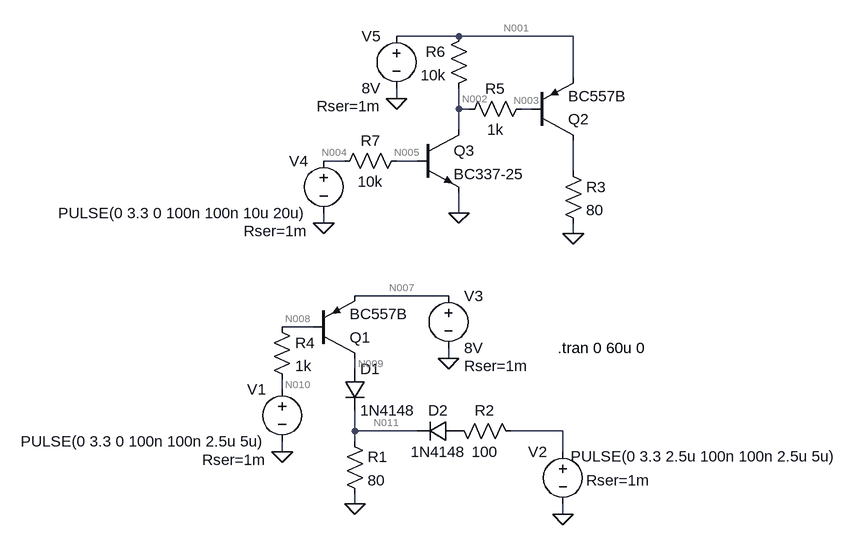
[diagram p0: schematic programador encoder.asc]
programador encoder.asc, the LTspice schematic file:
Version 4
SHEET 1 1852 684
WIRE 352 -208 256 -208
WIRE 528 -208 352 -208
WIRE 528 -144 528 -208
WIRE 256 -112 256 -128
WIRE 352 -96 352 -128
WIRE 368 -96 352 -96
WIRE 464 -96 448 -96
WIRE 352 -64 352 -96
WIRE 176 -16 144 -16
WIRE 288 -16 256 -16
WIRE 528 0 528 -48
WIRE 352 64 352 32
WIRE 144 80 144 64
WIRE 528 96 528 80
WIRE 336 192 192 192
WIRE 128 240 80 240
WIRE 336 288 336 272
WIRE 192 304 192 288
WIRE 80 336 80 320
WIRE 192 400 192 368
WIRE 288 400 192 400
WIRE 512 400 432 400
WIRE 192 416 192 400
WIRE 80 432 80 416
WIRE 512 432 512 400
WIRE 192 512 192 496
WIRE 512 528 512 512
FLAG 192 512 0
FLAG 80 432 0
FLAG 336 288 0
FLAG 512 528 0
FLAG 528 96 0
FLAG 144 80 0
FLAG 256 -112 0
FLAG 352 64 0
SYMBOL diode 176 304 R0
SYMATTR InstName D1
SYMATTR Value 1N4148
SYMBOL diode 352 416 M270
WINDOW 0 32 32 VTop 2
WINDOW 3 0 32 VBottom 2
SYMATTR InstName D2
SYMATTR Value 1N4148
SYMBOL res 176 400 R0
SYMATTR InstName R1
SYMATTR Value 80
SYMBOL res 336 384 M90
WINDOW 0 0 56 VBottom 2
WINDOW 3 32 56 VTop 2
SYMATTR InstName R2
SYMATTR Value 100
SYMBOL voltage 80 320 M0
WINDOW 39 24 124 Left 2
SYMATTR InstName V1
SYMATTR Value PULSE(0 3.3 0 100n 100n 2.5u 5u)
SYMATTR Value2 AC 5V 0
SYMATTR SpiceLine Rser=1m
SYMBOL res 64 224 R0
SYMATTR InstName R4
SYMATTR Value 1k
SYMATTR SpiceLine tol=5 pwr=0.25
SYMBOL voltage 336 176 R0
WINDOW 123 0 0 Left 2
WINDOW 39 24 124 Left 2
SYMATTR InstName V3
SYMATTR Value 8V
SYMATTR SpiceLine Rser=1m
SYMBOL pnp 128 288 M180
SYMATTR InstName Q1
SYMATTR Value BC557B
SYMBOL voltage 512 416 M0
WINDOW 3 -424 23 Left 2
WINDOW 39 -135 60 Left 2
SYMATTR InstName V2
SYMATTR Value PULSE(0 3.3 2.5u 100n 100n 2.5u 5u)
SYMATTR Value2 AC 5V 0
SYMATTR SpiceLine Rser=1m
SYMBOL res 512 -16 R0
SYMATTR InstName R3
SYMATTR Value 80
SYMBOL voltage 144 -32 M0
WINDOW 39 24 124 Left 2
SYMATTR InstName V4
SYMATTR Value PULSE(0 3.3 0 100n 100n 10u 20u)
SYMATTR Value2 AC 5V 0
SYMATTR SpiceLine Rser=1m
SYMBOL res 464 -112 R90
WINDOW 0 0 56 VBottom 2
WINDOW 3 32 56 VTop 2
SYMATTR InstName R5
SYMATTR Value 1k
SYMATTR SpiceLine tol=5 pwr=0.25
SYMBOL voltage 256 -224 M0
WINDOW 123 0 0 Left 2
WINDOW 39 24 124 Left 2
SYMATTR InstName V5
SYMATTR Value 8V
SYMATTR SpiceLine Rser=1m
SYMBOL pnp 464 -48 M180
SYMATTR InstName Q2
SYMATTR Value BC557B
SYMBOL res 368 -224 M0
SYMATTR InstName R6
SYMATTR Value 10k
SYMBOL npn 288 -64 R0
SYMATTR InstName Q3
SYMATTR Value BC337-25
SYMBOL res 160 0 R270
WINDOW 0 32 56 VTop 2
WINDOW 3 0 56 VBottom 2
SYMATTR InstName R7
SYMATTR Value 10k
SYMATTR SpiceLine tol=5 pwr=0.25
TEXT 504 272 Left 2 !.tran 0 60u 0

The netlist it stands for:
* programador encoder.asc
D1 N009 N011 1N4148
D2 P001 N011 1N4148
R1 N011 0 80
R2 P001 N012 100
V1 N010 0 PULSE(0 3.3 0 100n 100n 2.5u 5u) AC 5V 0 Rser=1m
R4 N008 N010 1k tol=5 pwr=0.25
V3 N007 0 8V Rser=1m
Q1 N009 N008 N007 0 BC557B
V2 N012 0 PULSE(0 3.3 2.5u 100n 100n 2.5u 5u) AC 5V 0 Rser=1m
R3 N006 0 80
V4 N004 0 PULSE(0 3.3 0 100n 100n 10u 20u) AC 5V 0 Rser=1m
R5 N003 N002 1k tol=5 pwr=0.25
V5 N001 0 8V Rser=1m
Q2 N006 N003 N001 0 BC557B
R6 N001 N002 10k
Q3 N002 N005 0 0 BC337-25
R7 N004 N005 10k tol=5 pwr=0.25
.model D D
.lib standard.dio
.model NPN NPN
.model PNP PNP
.lib standard.bjt
.tran 0 60u 0
.backanno
.end

* Results of the author's LTspice run, read from the files saved beside the schematic
* Operating Point, zero values left out:
*   V(n009) = 7.846 V
*   V(n011) = 7.01 V
*   V(p001) = 252.7 nV
*   V(n010) = 7.154 µV
*   V(n008) = 7.154 V
*   V(n007) = 8 V
*   V(n003) = 8 V
*   V(n002) = 8 V
*   V(n001) = 8 V
*   V(n005) = 81.97 nV
*   Ic(Q3) = 8.239 pA
*   Ib(Q3) = -8.197 pA
*   Ic(Q2) = -8.34 pA
*   Ib(Q2) = 8.288 pA
*   Ic(Q1) = -87.62 mA
*   Ib(Q1) = -7.154 mA
*   Ie(Q1) = 94.78 mA
*   I(D2) = -2.527 nA
*   I(D1) = 87.62 mA
*   I(R7) = -8.197 pA
*   I(R6) = 16.53 pA
*   I(R5) = -8.288 pA
*   I(R3) = 8.34 pA
*   I(R4) = 7.154 mA
*   I(R2) = 2.527 nA
*   I(R1) = 87.62 mA
*   I(V5) = -16.37 pA
*   I(V4) = 8.197 pA
*   I(V2) = 2.527 nA
*   I(V3) = -94.78 mA
*   I(V1) = 7.154 mA
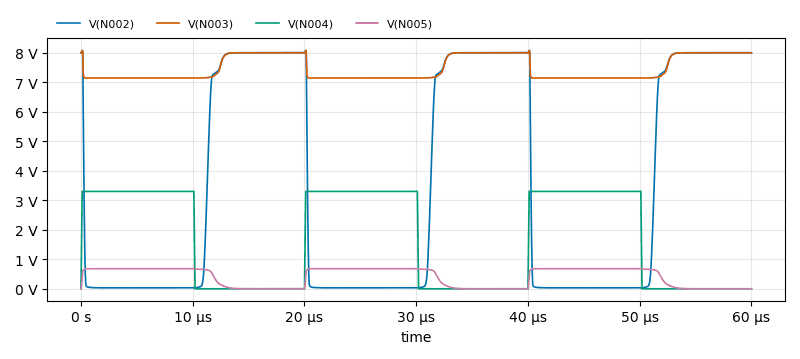
[diagram p1: Transient Analysis of programador encoder.asc, plotted from the saved traces]
* Transient Analysis, 1 run:
*   V(N002): min 31.99 mV, max 8.081 V, average 3.558 V, rms 5.247 V, last 8 V
*   V(N003): min 7.145 V, max 8.077 V, average 7.476 V, rms 7.487 V, last 8 V
*   V(N004): min 0 V, max 3.3 V, average 1.666 V, rms 2.341 V, last 0 V
*   V(N005): min 81.97 nV, max 682.1 mV, average 408.1 mV, rms 519 mV, last 87.49 nV